# Altium schematic sheet Int_LDOs.SchDoc
size 420 x 297 mm; Address1: Address1; Address2: Address2; Address3: Address3; Address4: Address4; SheetNumber: 1; Scale: 1:1; Разраб.: Иванов; Обозначение документа: АБВГ.123456.001 Э3; Пров.: Петров; Утв.: Сидоров; Наименование организации: ОАО "Концерн "МПО-Гидроприбор"; Перв. применение: АБВГ.123456.000; Наименование изделия 1: Плата; Наименование изделия 2: Схема электрическая; Наименование изделия 3: принципиальная; Нач. отд.: Нач. отд.; Фамилия нач. отд.: Сидоров
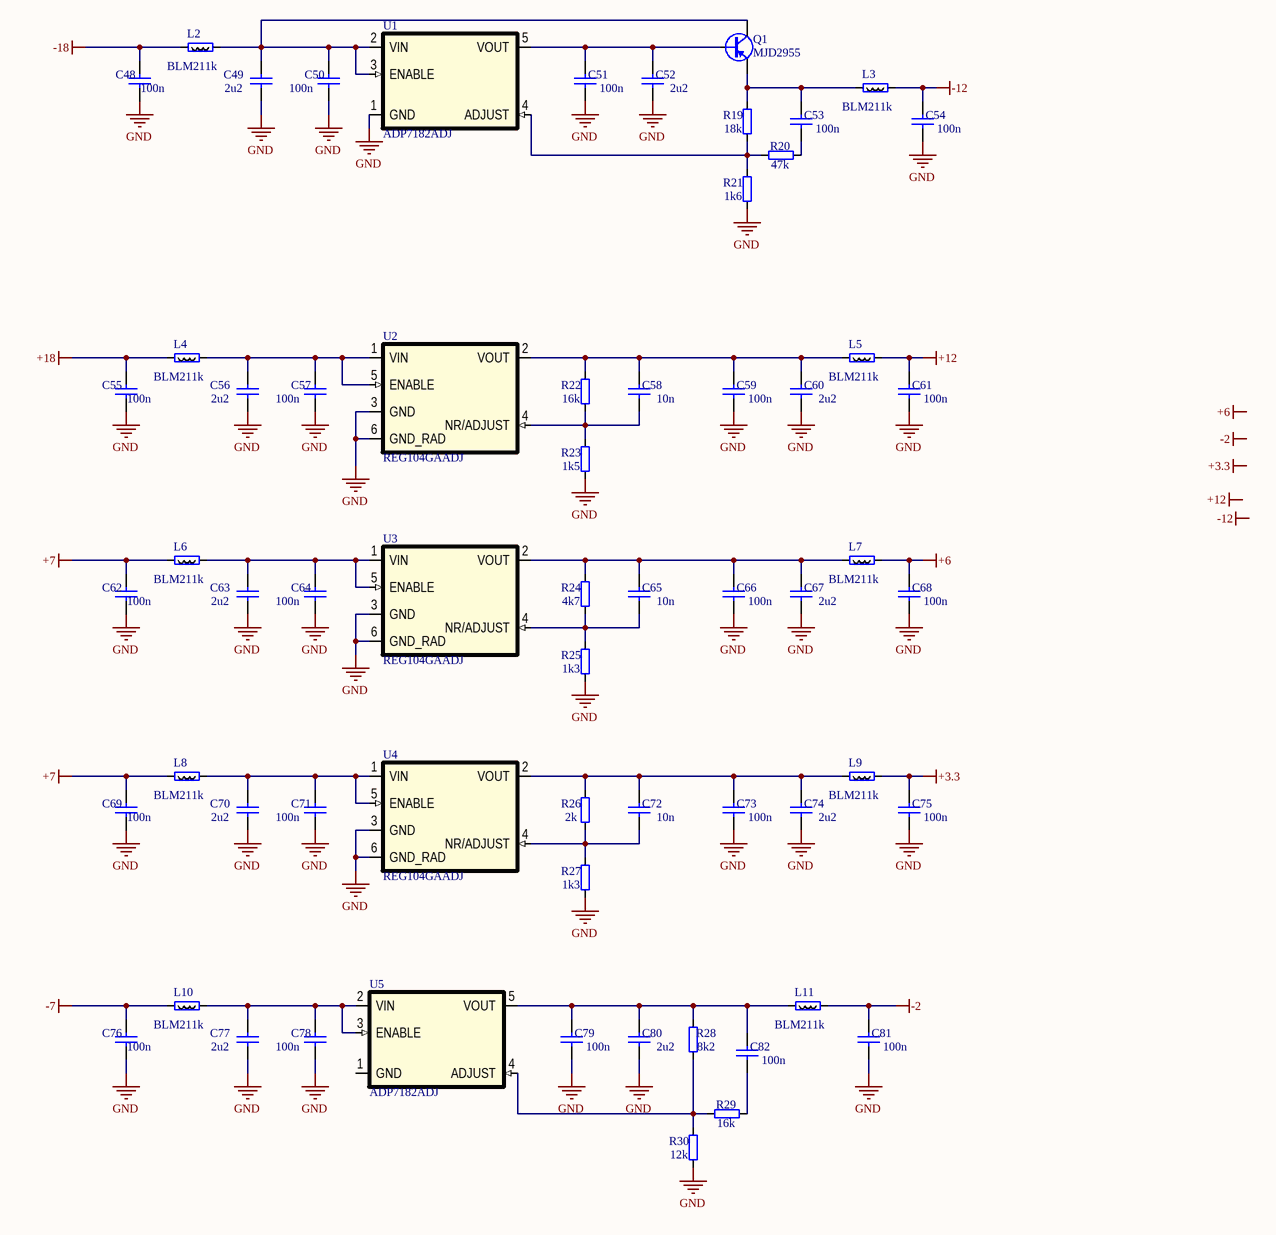
[diagram p0: Int_LDOs.SchDoc]

## Parts
C48  100n  [0603]
C49  2u2  [0805]
C50  100n  [0603]
C51  100n  [0603]
C52  2u2  [0805]
C53  100n  [0603]
C54  100n  [0603]
C55  100n  [0603]
C56  2u2  [0805]
C57  100n  [0603]
C58  10n  [0603]
C59  100n  [0603]
C60  2u2  [0805]
C61  100n  [0603]
C62  100n  [0603]
C63  2u2  [0805]
C64  100n  [0603]
C65  10n  [0603]
C66  100n  [0603]
C67  2u2  [0805]
C68  100n  [0603]
C69  100n  [0603]
C70  2u2  [0805]
C71  100n  [0603]
C72  10n  [0603]
C73  100n  [0603]
C74  2u2  [0805]
C75  100n  [0603]
C76  100n  [0603]
C77  2u2  [0805]
C78  100n  [0603]
C79  100n  [0603]
C80  2u2  [0805]
C81  100n  [0603]
C82  100n  [0603]
L2  BLM211k  [0805]
L3  BLM211k  [0805]
L4  BLM211k  [0805]
L5  BLM211k  [0805]
L6  BLM211k  [0805]
L7  BLM211k  [0805]
L8  BLM211k  [0805]
L9  BLM211k  [0805]
L10  BLM211k  [0805]
L11  BLM211k  [0805]
Q1  MJD2955  [DPAK]
R19  18k  [0603]
R20  47k  [0603]
R21  1k6  [0603]
R22  16k  [0603]
R23  1k5  [0603]
R24  4k7  [0603]
R25  1k3  [0603]
R26  2k  [0603]
R27  1k3  [0603]
R28  8k2  [0603]
R29  16k  [0603]
R30  12k  [0603]
U1  ADP7182ADJ  [SOT23-5]
U2  REG104GAADJ  [SOT223_6-127]
U3  REG104GAADJ  [SOT223_6-127]
U4  REG104GAADJ  [SOT223_6-127]
U5  ADP7182ADJ  [SOT23-5]

## Nets
+3.3: C75.2 L9.2
+6: C68.2 L7.2
+7: C62.2 C69.2 L6.1 L8.1
+12: C61.2 L5.2
+18: C55.2 L4.1
-2: C81.2 L11.2
-7: C76.2 L10.1
-12: C54.2 L3.2
-18: C48.2 L2.1
GND: C48.1 C49.1 C50.1 C51.1 C52.1 C54.1 C55.1 C56.1 C57.1 C59.1 C60.1 C61.1 C62.1 C63.1 C64.1 C66.1 C67.1 C68.1 C69.1 C70.1 C71.1 C73.1 C74.1 C75.1 C76.1 C77.1 C78.1 C79.1 C80.1 C81.1 R21.1 R23.1 R25.1 R27.1 R30.1 U1.1(GND) U2.3(GND) U2.6(GND_RAD) U3.3(GND) U3.6(GND_RAD) U4.3(GND) U4.6(GND_RAD)
NetC49_2: C49.2 C50.2 L2.2 Q1.3(C) U1.2(VIN) U1.3(ENABLE)
NetC51_2: C51.2 C52.2 Q1.1(B) U1.5(VOUT)
NetC53_1: C53.1 R20.2
NetC53_2: C53.2 L3.1 Q1.2(E) R19.2
NetC56_2: C56.2 C57.2 L4.2 U2.1(VIN) U2.5(ENABLE)
NetC58_1: C58.1 R22.1 R23.2 U2.4(NR/ADJUST)
NetC58_2: C58.2 C59.2 C60.2 L5.1 R22.2 U2.2(VOUT)
NetC63_2: C63.2 C64.2 L6.2 U3.1(VIN) U3.5(ENABLE)
NetC65_1: C65.1 R24.1 R25.2 U3.4(NR/ADJUST)
NetC65_2: C65.2 C66.2 C67.2 L7.1 R24.2 U3.2(VOUT)
NetC70_2: C70.2 C71.2 L8.2 U4.1(VIN) U4.5(ENABLE)
NetC72_1: C72.1 R26.1 R27.2 U4.4(NR/ADJUST)
NetC72_2: C72.2 C73.2 C74.2 L9.1 R26.2 U4.2(VOUT)
NetC77_2: C77.2 C78.2 L10.2 U5.2(VIN) U5.3(ENABLE)
NetC79_2: C79.2 C80.2 C82.2 L11.1 R28.2 U5.5(VOUT)
NetC82_1: C82.1 R29.2
NetR19_1: R19.1 R20.1 R21.2 U1.4(ADJUST)
NetR28_1: R28.1 R29.1 R30.2 U5.4(ADJUST)

Not connected (* = marked no-connect by the designer): U5 1(GND)

## Notes on the sheet
- Labels drawn without touching a wire or pin: +3.3, +6, +12, -2, -12
- Подп. и дата
- Инв. № дубл.
- Взам. инв. №
- Инв. № подл.
- Изм.
- Лист
- № докум.
- Подп.
- Дата
- Копировал
- Формат А3

## Library data of the parts
C48-C82 = Capacitor
L2-L11 = BLM21: SMD Ferrite bead 0805; Vendor: Vishay; Value: 1k; Pkg: SMD0805; SMD Solders: 2; Solder Option: RM; Price: 10; Device: BLM21
Q1 = MJD2955: PNP транзистор; Vendor: ON Semiconductor; SMD Solders: 3; Solder Option: RM; Name to order: MJD29G55; Voltage: -60V; Pkg: DPAK; Price: 100; Device: MJD2955
R19-R30 = Resistor
U1 U5 = ADP7182: Negative LDO Linear stabilizer; Vendor: Analog Devoces; Value: ADJ; SMD Solders: 5; Solder Option: RM; Name to order: ADP7182AUJZ-R7; Vref: 1V22; Pkg: SOT23-5; Price: 100; Device: ADP7182
U2-U4 = REG104GA: Positive LDO Linear stabilizer; Vendor: Texas Instruments; Value: ADJ; SMD Solders: 6; Solder Option: RM; TC: 70ppm/C; Tolerance: +-2% Max; Pkg: SOT223-6; Name to order: REG104GA-A; Vref: 1V295; Price: 1000; Device: REG104GA